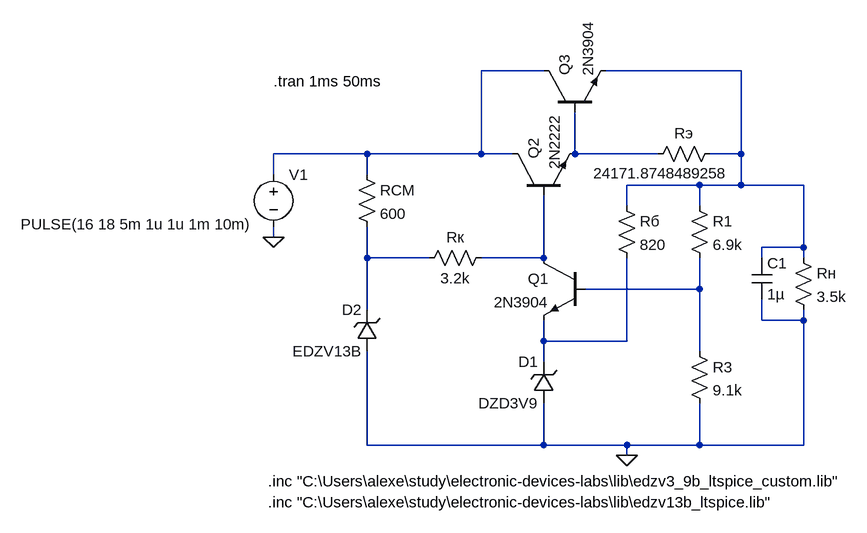
[diagram p0: schematic scheme12.asc]
scheme12.asc, the LTspice schematic file:
Version 4.1
SHEET 1 976 680
WIRE 400 -80 304 -80
WIRE 704 -80 496 -80
WIRE 128 48 -16 48
WIRE 304 48 304 -80
WIRE 304 48 128 48
WIRE 352 48 304 48
WIRE 448 48 448 -16
WIRE 576 48 448 48
WIRE 704 48 704 -80
WIRE 704 48 656 48
WIRE -16 80 -16 48
WIRE 128 80 128 48
WIRE 640 96 528 96
WIRE 704 96 704 48
WIRE 704 96 640 96
WIRE 800 96 704 96
WIRE 528 128 528 96
WIRE 640 128 640 96
WIRE -16 176 -16 160
WIRE 800 192 800 96
WIRE 800 192 736 192
WIRE 128 208 128 160
WIRE 224 208 128 208
WIRE 400 208 400 112
WIRE 400 208 304 208
WIRE 736 208 736 192
WIRE 800 208 800 192
WIRE 640 256 640 208
WIRE 640 256 464 256
WIRE 128 288 128 208
WIRE 736 304 736 272
WIRE 800 304 800 288
WIRE 800 304 736 304
WIRE 400 336 400 304
WIRE 528 336 528 208
WIRE 528 336 400 336
WIRE 640 352 640 256
WIRE 400 368 400 336
WIRE 128 496 128 352
WIRE 400 496 400 432
WIRE 400 496 128 496
WIRE 528 496 400 496
WIRE 640 496 640 432
WIRE 640 496 528 496
WIRE 800 496 800 304
WIRE 800 496 640 496
WIRE 528 512 528 496
FLAG -16 176 0
FLAG 528 512 0
SYMBOL voltage -16 64 R0
WINDOW 3 -389 92 Left 2
SYMATTR InstName V1
SYMATTR Value PULSE(16 18 5m 1u 1u 1m 10m)
SYMBOL zener 416 432 R180
WINDOW 0 24 64 Left 2
WINDOW 3 24 0 Left 2
SYMATTR InstName D1
SYMATTR Value DZD3V9
SYMBOL zener 144 352 R180
WINDOW 0 24 64 Left 2
WINDOW 3 24 0 Left 2
SYMATTR InstName D2
SYMATTR Value EDZV13B
SYMBOL res 624 112 R0
SYMATTR InstName R1
SYMATTR Value 6.9k
SYMBOL res 624 336 R0
SYMATTR InstName R3
SYMATTR Value 9.1k
SYMBOL res 112 64 R0
SYMATTR InstName RСМ
SYMATTR Value 600
SYMBOL res 320 192 R90
WINDOW 0 0 56 VBottom 2
WINDOW 3 32 56 VTop 2
SYMATTR InstName Rк
SYMATTR Value 3.2k
SYMBOL res 672 32 R90
WINDOW 0 0 56 VBottom 2
WINDOW 3 30 91 VTop 2
SYMATTR InstName Rэ
SYMATTR Value 24171.8748489258
SYMBOL npn 464 208 M0
SYMATTR InstName Q1
SYMATTR Value 2N3904
SYMBOL npn 352 112 R270
WINDOW 3 40 65 Left 2
SYMATTR Value 2N2222
SYMATTR InstName Q2
SYMBOL npn 400 -16 R270
SYMATTR InstName Q3
SYMATTR Value 2N3904
SYMBOL res 512 112 R0
SYMATTR InstName Rб
SYMATTR Value 820
SYMBOL res 784 192 R0
SYMATTR InstName Rн
SYMATTR Value 3.5k
SYMBOL cap 720 208 R0
SYMATTR InstName C1
SYMATTR Value 1µ
TEXT -16 -64 Left 2 !.tran 1ms 50ms
TEXT -24 552 Left 2 !.inc "C:\\Users\\alexe\\study\\electronic-devices-labs\\lib\\edzv3_9b_ltspice_custom.lib"
TEXT -24 584 Left 2 !.inc "C:\\Users\\alexe\\study\\electronic-devices-labs\\lib\\edzv13b_ltspice.lib"

The netlist it stands for:
* scheme12.asc
V1 N001 0 PULSE(16 18 5m 1u 1u 1m 10m)
D1 0 N007 DZD3V9
D2 0 N004 EDZV13B
R1 N002 N006 6.9k
R3 N006 0 9.1k
RСМ N001 N004 600
Rк N005 N004 3.2k
Rэ N002 N003 24171.8748489258
Q1 N005 N006 N007 0 2N3904
Q2 N001 N005 N003 0 2N2222
Q3 N001 N003 N002 0 2N3904
Rб N002 N007 820
Rн N002 0 3.5k
C1 N002 0 1µ
.model D D
.lib standard.dio
.model NPN NPN
.model PNP PNP
.lib standard.bjt
.tran 1ms 50ms
.inc "C:\Users\alexe\study\electronic-devices-labs\lib\edzv3_9b_ltspice_custom.lib"
.inc "C:\Users\alexe\study\electronic-devices-labs\lib\edzv13b_ltspice.lib"
.backanno
.end